# Altium schematic sheet Sheet6.SchDoc
size A4
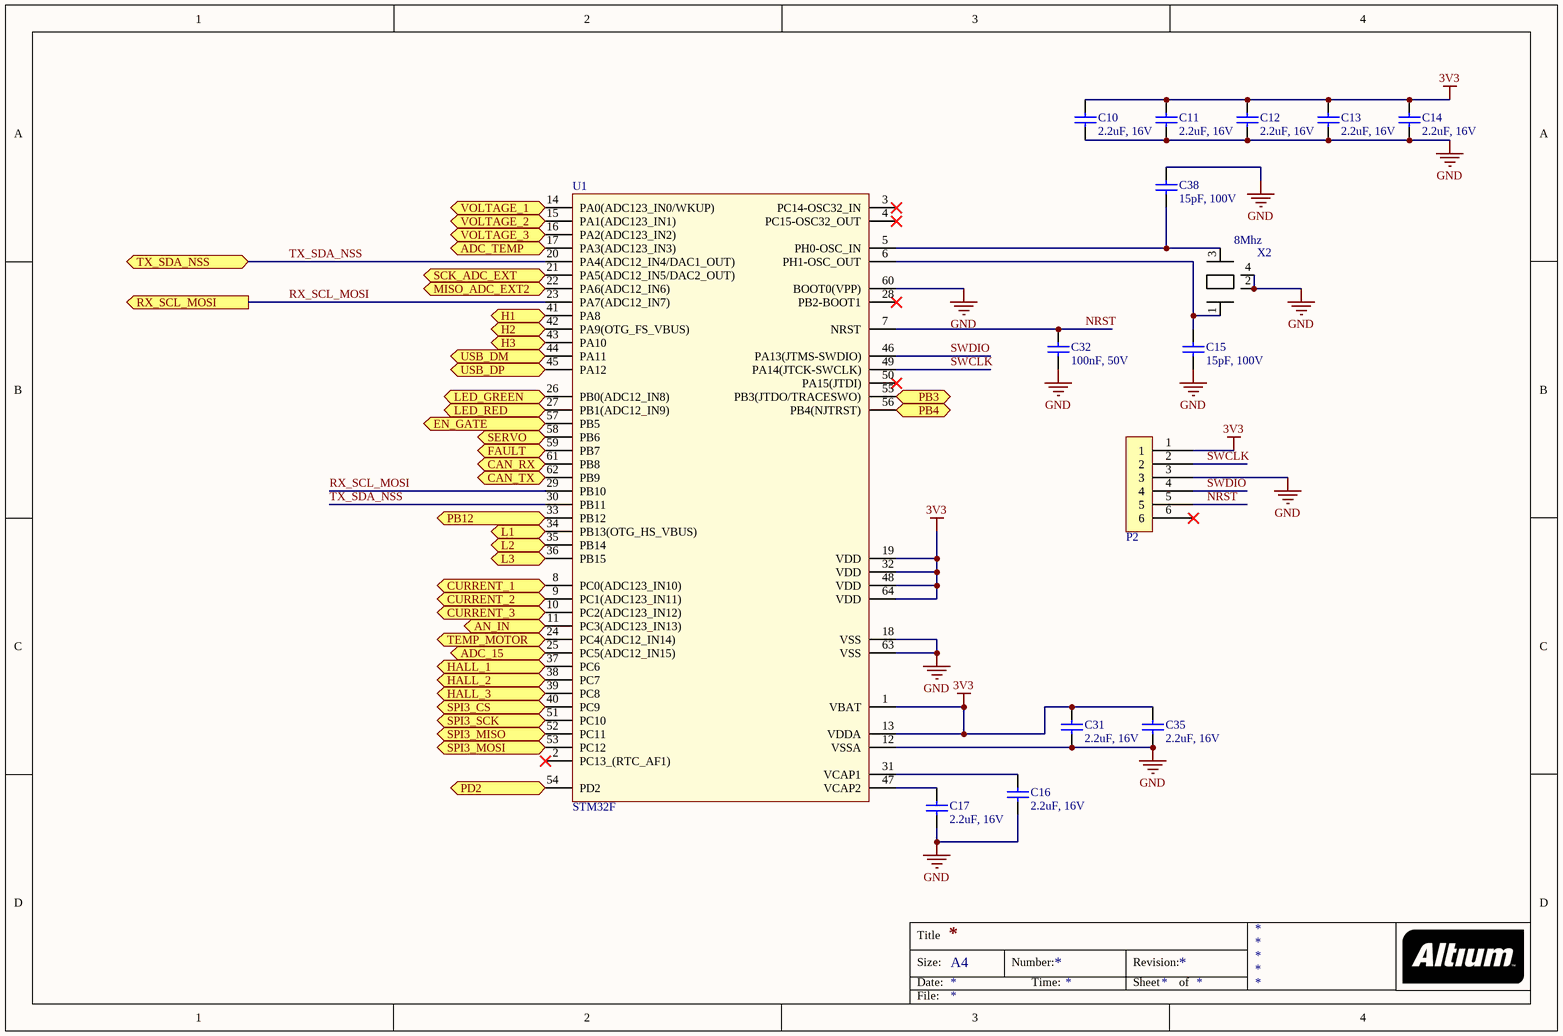
[diagram p0: Sheet6.SchDoc]

## Parts
C10  value 2.2uF, 16V  [SMD-0603 Capacitor]  (hidden comment: Voltage important)
C11  value 2.2uF, 16V  [SMD-0603 Capacitor]  (hidden comment: Voltage important)
C12  value 2.2uF, 16V  [SMD-0603 Capacitor]  (hidden comment: Voltage important)
C13  value 2.2uF, 16V  [SMD-0603 Capacitor]  (hidden comment: Voltage important)
C14  value 2.2uF, 16V  [SMD-0603 Capacitor]  (hidden comment: Voltage important)
C15  value 15pF, 100V  [SMD-0603 Capacitor]  (hidden comment: CAP)
C16  value 2.2uF, 16V  [SMD-0603 Capacitor]  (hidden comment: Voltage important)
C17  value 2.2uF, 16V  [SMD-0603 Capacitor]  (hidden comment: Voltage important)
C31  value 2.2uF, 16V  [SMD-0603 Capacitor]  (hidden comment: Voltage important)
C32  value 100nF, 50V  [SMD-0603 Capacitor]  (hidden comment: Voltage important)
C35  value 2.2uF, 16V  [SMD-0603 Capacitor]  (hidden comment: Voltage important)
C38  value 15pF, 100V  [SMD-0603 Capacitor]  (hidden comment: CAP)
P2  B6B-PH-K-S(LF)(SN)  [JST PH TH VERT 6]  (value not drawn)
U1  STM32F  [TSQFP50P1200X1200X160-64]
X2  value 8Mhz  [4-SMD CRYSTAL 5X3.2mm]  (hidden comment: OSC_1)

## Ports
ADC_15 (out), ADC_TEMP (in), AN_IN (in), CAN_RX (in), CAN_TX (out), CURRENT_1 (in), CURRENT_2 (in), CURRENT_3 (in), EN_GATE (out), FAULT (in), H1 (out), H2 (out), H3 (out), HALL_1 (in), HALL_2 (in), HALL_3 (in), L1 (out), L2 (out), L3 (out), LED_GREEN (in), LED_RED (in), MISO_ADC_EXT2 (in), PB3 (out), PB4 (out), PB12 (in), PD2 (out), RX_SCL_MOSI (out), SCK_ADC_EXT (in), SERVO (out), SPI3_CS (in), SPI3_MISO (in), SPI3_MOSI (in), SPI3_SCK (in), TEMP_MOTOR (out), TX_SDA_NSS (bidir), USB_DM (bidir), USB_DP (bidir), VOLTAGE_1 (in), VOLTAGE_2 (in), VOLTAGE_3 (in)

## Nets
3V3: C10.2 C11.2 C12.2 C13.2 C14.2 C31.2 C35.2 P2.1 U1.1(VBAT) U1.13(VDDA) U1.19(VDD) U1.32(VDD) U1.48(VDD) U1.64(VDD)
GND: C10.1 C11.1 C12.1 C13.1 C14.1 C15.1 C16.1 C17.1 C31.1 C32.1 C35.1 C38.2 P2.3 U1.12(VSSA) U1.18(VSS) U1.60(BOOT0(VPP)) U1.63(VSS) X2.2 X2.4
ADC_15: U1.25(PC5(ADC12_IN15)) ; port ADC_15
ADC_TEMP: U1.17(PA3(ADC123_IN3)) ; port ADC_TEMP
AN_IN: U1.11(PC3(ADC123_IN13)) ; port AN_IN
CAN_RX: U1.61(PB8) ; port CAN_RX
CAN_TX: U1.62(PB9) ; port CAN_TX
CURRENT_1: U1.8(PC0(ADC123_IN10)) ; port CURRENT_1
CURRENT_2: U1.9(PC1(ADC123_IN11)) ; port CURRENT_2
CURRENT_3: U1.10(PC2(ADC123_IN12)) ; port CURRENT_3
EN_GATE: U1.57(PB5) ; port EN_GATE
FAULT: U1.59(PB7) ; port FAULT
H1: U1.41(PA8) ; port H1
H2: U1.42(PA9(OTG_FS_VBUS)) ; port H2
H3: U1.43(PA10) ; port H3
HALL_1: U1.37(PC6) ; port HALL_1
HALL_2: U1.38(PC7) ; port HALL_2
HALL_3: U1.39(PC8) ; port HALL_3
L1: U1.34(PB13(OTG_HS_VBUS)) ; port L1
L2: U1.35(PB14) ; port L2
L3: U1.36(PB15) ; port L3
LED_GREEN: U1.26(PB0(ADC12_IN8)) ; port LED_GREEN
LED_RED: U1.27(PB1(ADC12_IN9)) ; port LED_RED
MISO_ADC_EXT2: U1.22(PA6(ADC12_IN6)) ; port MISO_ADC_EXT2
NRST: C32.2 P2.5 U1.7(NRST)
PB3: U1.55(PB3(JTDO/TRACESWO)) ; port PB3
PB4: U1.56(PB4(NJTRST)) ; port PB4
PB12: U1.33(PB12) ; port PB12
PD2: U1.54(PD2) ; port PD2
RX_SCL_MOSI: U1.23(PA7(ADC12_IN7)) U1.29(PB10) ; port RX_SCL_MOSI
SCK_ADC_EXT: U1.21(PA5(ADC12_IN5/DAC2_OUT)) ; port SCK_ADC_EXT
SERVO: U1.58(PB6) ; port SERVO
SPI3_CS: U1.40(PC9) ; port SPI3_CS
SPI3_MISO: U1.52(PC11) ; port SPI3_MISO
SPI3_MOSI: U1.53(PC12) ; port SPI3_MOSI
SPI3_SCK: U1.51(PC10) ; port SPI3_SCK
SWCLK: P2.2 U1.49(PA14(JTCK-SWCLK))
SWDIO: P2.4 U1.46(PA13(JTMS-SWDIO))
TEMP_MOTOR: U1.24(PC4(ADC12_IN14)) ; port TEMP_MOTOR
TX_SDA_NSS: U1.20(PA4(ADC12_IN4/DAC1_OUT)) U1.30(PB11) ; port TX_SDA_NSS
USB_DM: U1.44(PA11) ; port USB_DM
USB_DP: U1.45(PA12) ; port USB_DP
VOLTAGE_1: U1.14(PA0(ADC123_IN0/WKUP)) ; port VOLTAGE_1
VOLTAGE_2: U1.15(PA1(ADC123_IN1)) ; port VOLTAGE_2
VOLTAGE_3: U1.16(PA2(ADC123_IN2)) ; port VOLTAGE_3
NetC15_2: C15.2 U1.6(PH1-OSC_OUT) X2.1
NetC16_2: C16.2 U1.31(VCAP1)
NetC17_2: C17.2 U1.47(VCAP2)
NetC38_1: C38.1 U1.5(PH0-OSC_IN) X2.3

Not connected (* = marked no-connect by the designer): P2 6*; U1 2(PC13_(RTC_AF1))* 3(PC14-OSC32_IN)* 4(PC15-OSC32_OUT)* 28(PB2-BOOT1)* 50(PA15(JTDI))*

## Notes on the sheet
- Title
- Size:
- Date:
- A4
- Number:
- Time:
- Revision:
- Sheet
- of
- File:

## Library data of the parts
C10-C14 C16 C17 C31 C35 = 9: CAP 2.2u, 16V, 0603; Manufacturer Part Number: C1608X5R1C225M; Manufacturer: TDK Corporation; ID: 9; Place (YES/NO): YES
C15 C38 = 3: CAP 15p, 100V, 0603; Manufacturer Part Number: GRM1885C2A150JA01; Manufacturer: Murata Electronics North America; ID: 3; Place (YES/NO): YES
C32 = 7: CAP 100n, 50V, 0603; Manufacturer Part Number: 06035C104JAT2A; Manufacturer: AVX Corporation; ID: 7; Place (YES/NO): YES
P2 = 3: JST PH Through hole Vertical 6 Pin; ID: 3; Value: JST PH 6 PIN; Place (YES/NO): YES; Manufacturer Part Number: B6B-PH-K-S(LF)(SN); Manufacturer: JST
U1 = 4: IC MCU 32BIT 1MB FLASH 64LQFP; Manufacturer Part Number: STM32F405RGT6; Manufacturer: STMicroelectronics; ID: 4; Place (YES/NO): YES
X2 = 1: Crystal 8MHz, 10PPM; Manufacturer Part Number: ABM3B-8.0-10-1UT; Manufacturer: Abracon LLC; ID: 1; Place (YES/NO): YES